# Altium schematic sheet main.SchDoc
size A4
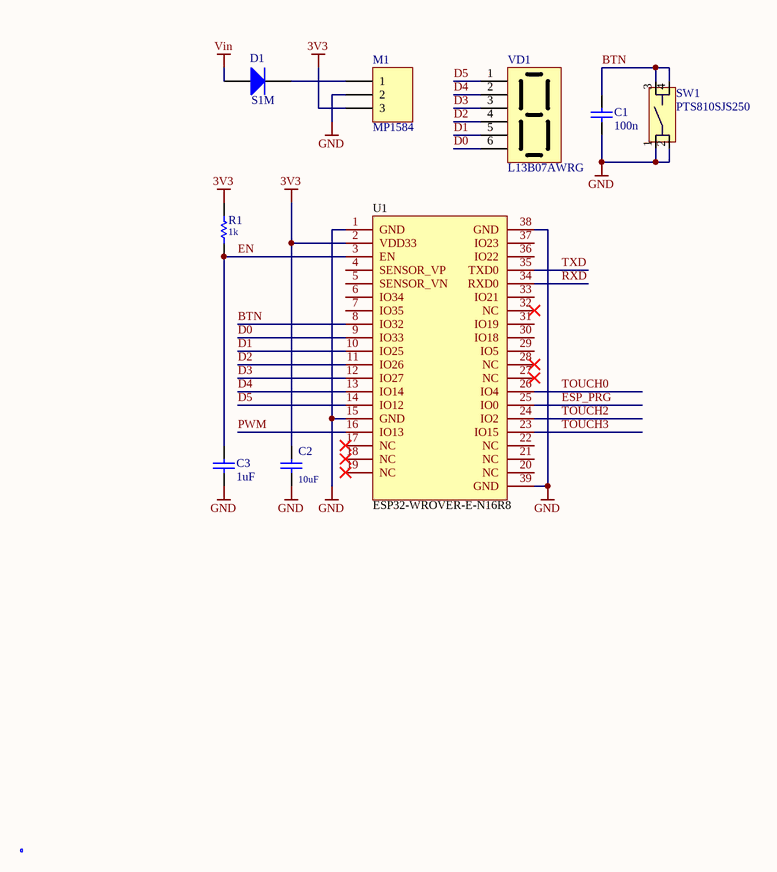
[diagram p0: main.SchDoc]

## Parts
C1  100n  [C0402]
C2  10uF  [C0805]
C3  1uF  [C1206]
D1  S1M  [SMA]
LOGO1  LOGO  [LOGO]  (value not drawn)  (no BOM)
M1  MP1584  [MP1584_module]  (no BOM)
R1  1k  [R0603]
SW1  PTS810SJS250  [BTN_PTS810]
U1  ESP32-WROVER-E-N16R8  [WIFIM-SMD_39P-L31.4-W18.0-P1.27]
VD1  L13B07AWRG  [L13B07AWRG]

## Nets
3V3: C2.2 M1.3 R1.1 U1.2(VDD33)
GND: C1.1 C2.1 C3.1 M1.2 SW1.1 SW1.2 U1.1(GND) U1.15(GND) U1.38(GND) U1.39(GND)
Vin: D1.1(A)
BTN: C1.2 SW1.3 SW1.4 U1.8(IO32)
D0: U1.9(IO33) VD1.6
D1: U1.10(IO25) VD1.5
D2: U1.11(IO26) VD1.4
D3: U1.12(IO27) VD1.3
D4: U1.13(IO14) VD1.2
D5: U1.14(IO12) VD1.1
EN: C3.2 R1.2 U1.3(EN)
ESP_PRG: U1.25(IO0)
PWM: U1.16(IO13)
RXD: U1.34(RXD0)
TOUCH0: U1.26(IO4)
TOUCH2: U1.24(IO2)
TOUCH3: U1.23(IO15)
TXD: U1.35(TXD0)
NetD1_2: D1.2(K) M1.1

Not connected (* = marked no-connect by the designer): U1 4(SENSOR_VP) 5(SENSOR_VN) 6(IO34) 7(IO35) 17(NC)* 18(NC)* 19(NC)* 20(NC) 21(NC) 22(NC) 27(NC)* 28(NC)* 29(IO5) 30(IO18) 31(IO19) 32(NC)* 33(IO21) 36(IO22) 37(IO23)

## Library data of the parts
C1 C3 = Cap
C2 = CAP
D1 = US1M-13-F
M1 = Header 3
R1 = RES: 1k 0603
SW1 = Component_1: P/N: PTS810SJK250SMTRLFS; LCSC part number: C221896
U1 = ESP32-WROVER-E-N16R8: Manufacturer: ESPRESSIF(乐鑫); Symbol: ESP32-WROVER-E(16MB); Add into BOM: yes; Device: ESP32-WROVER-E-N16R8; LCSC Part Name: 通用型Wi-Fi+BT+BLE MCU模组; Supplier Part: C529589; Manufacturer Part: ESP32-WROVER-E-N16R8; Supplier Footprint: SMD,18x31.4mm; JLCPCB Part Class: Extended Part; Datasheet: https://atta.szlcsc.com/upload/public/pdf/source/20241030/69A66968DE36EDB45130F1579BF46A5B.pdf; Supplier: LCSC; Convert to PCB: yes